# Altium schematic sheet motor-driver.SchDoc
size A4; DrawnBy: Lorna Lan; Organization: UTAT SS; DocumentNumber: 2; Revision: V1; SheetNumber: 3; SheetTotal: 7
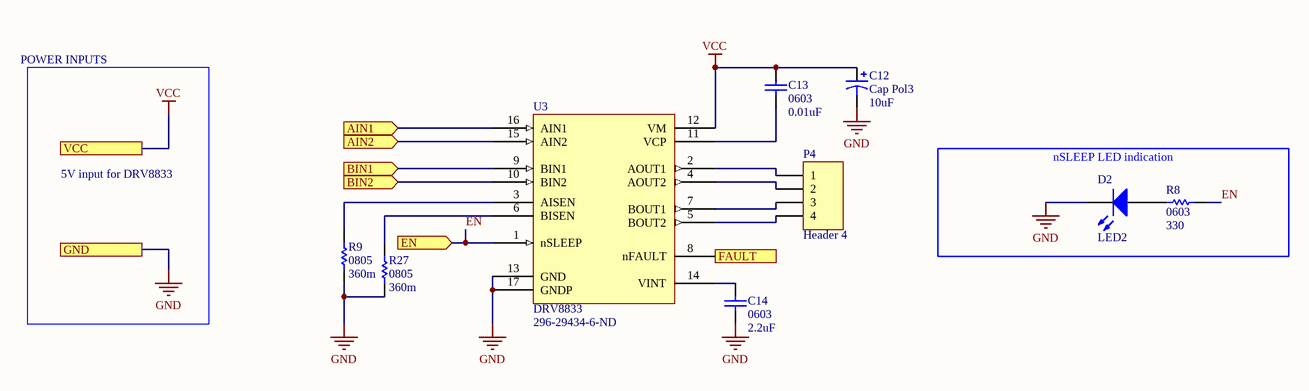
[diagram p0: motor-driver.SchDoc]

## Parts
C12  Cap Pol3  value 10uF  [CAP DIA12.5mm]
C13  0603  value 0.01uF  [0603-RES]
C14  0603  value 2.2uF  [0603-RES]
D2  LED2  [0603-LED]
P4  Header 4  [MOLEX_504050-0491]
R8  0603  value 330  [0603-RES]
R9  0805  value 360m  [6-0805_M]
R27  0805  value 360m  [6-0805_M]
U3  DRV8833  Supplier Part Number 1: 296-29434-6-ND  [SOP65P640X120-17N]

## Ports
AIN1 (in), AIN2 (in), BIN1 (in), BIN2 (in), EN (in), FAULT (out), GND, VCC

## Nets
GND: C12.2 C14.1 D2.2(K) R9.1 R27.1 U3.13(GND) U3.17(GNDP) ; port GND
VCC: C12.1 C13.1 U3.12(VM) ; port VCC
AIN1: U3.16(AIN1) ; port AIN1
AIN2: U3.15(AIN2) ; port AIN2
BIN1: U3.9(BIN1) ; port BIN1
BIN2: U3.10(BIN2) ; port BIN2
EN: R8.2 U3.1(nSLEEP) ; port EN
FAULT: U3.8(nFAULT) ; port FAULT
NetC13_2: C13.2 U3.11(VCP)
NetC14_2: C14.2 U3.14(VINT)
NetD2_1: D2.1(A) R8.1
NetP4_1: P4.1 U3.2(AOUT1)
NetP4_2: P4.2 U3.4(AOUT2)
NetP4_3: P4.3 U3.7(BOUT1)
NetP4_4: P4.4 U3.5(BOUT2)
NetR9_2: R9.2 U3.3(AISEN)
NetR27_2: R27.2 U3.6(BISEN)

## Notes on the sheet
- POWER INPUTS
- 5V input for DRV8833
- nSLEEP LED indication

## Library data of the parts
C12 = Cap Pol3: Polarized Capacitor (through hole); Published: 8-Jun-2000; LatestRevisionDate: 29-May-2009; LatestRevisionNote: IPC-7351 Footprint Added.; PackageReference: C0805; Publisher: Altium Limited; PackageDescription: Chip Capacitor; ComponentLink1Description: Digikey Link; ComponentLink1URL: https://www.digikey.ca/product-detail/en/nichicon/UCA2W100MHD1TO/493-4781-1-ND/3129119
C13 C14 = Cap: Capacitor; Published: 8-Jun-2000; LatestRevisionDate: 17-Jul-2002; LatestRevisionNote: Re-released for DXP Platform.; PackageReference: RAD-0.3; Publisher: Altium Limited; PackageDescription: Radial Cap, Thru-Hole; 2 Leads; 0.3 in Pin Spacing; ComponentLink1Description: Digikey Link
  C13: ComponentLink1URL: https://www.digikey.ca/product-detail/en/yageo/CC0603ZRY5V9BB104/311-1343-1-ND/2103127
  C14: ComponentLink1URL: https://www.digikey.ca/product-detail/en/yageo/CC0603ZRY5V5BB225/311-1452-1-ND/2833758
D2 = LED2: Typical RED, GREEN, YELLOW, AMBER GaAs LED; Published: 8-Jun-2000; LatestRevisionDate: 17-Jul-2002; LatestRevisionNote: Re-released for DXP Platform.; PackageVersion: Feb-2002; PackageReference: 3.2X1.6X1.1; Publisher: Altium Limited; PackageDescription: SM LED; 2 Flat Leads
P4 = Header 4: Header, 4-Pin; LatestRevisionDate: 17-Jul-2002; LatestRevisionNote: Re-released for DXP Platform.; Publisher: Altium Limited
R8 R9 R27 = Res1: Resistor; Published: 8-Jun-2000; LatestRevisionDate: 17-Jul-2002; LatestRevisionNote: Re-released for DXP Platform.; PackageReference: AXIAL-0.3; Publisher: Altium Limited; PackageDescription: Axial Device, Thru-Hole; 2 Leads; 0.3 in Pin Spacing
  R8: ComponentLink1Description: Digikey Link; ComponentLink1URL: https://www.digikey.ca/product-detail/en/yageo/RC0603FR-07330RL/311-330HRCT-ND/730109
  R9 R27: ComponentLink1Description: Digikey Link 1; ComponentLink1URL: https://www.digikey.ca/product-detail/en/vishay-dale/RCWE0805R360FKEA/RCWE.36DCT-ND/2276707; ComponentLink2Description: Digikey Link 2; ComponentLink2URL: https://www.digikey.ca/product-detail/en/panasonic-electronic-components/ERJ-6DQFR36V/P19297CT-ND/6004652
U3 = DRV8833: Simple Dual H-bridge motor driver (with 2 NMOFETS). Supply voltage range 2.7V~10.8V, output current up to 2A per H-bridge (coil); Supplier 1: Digi-Key